# EAGLE design Rain_alarm (EAGLE 9.6.2)
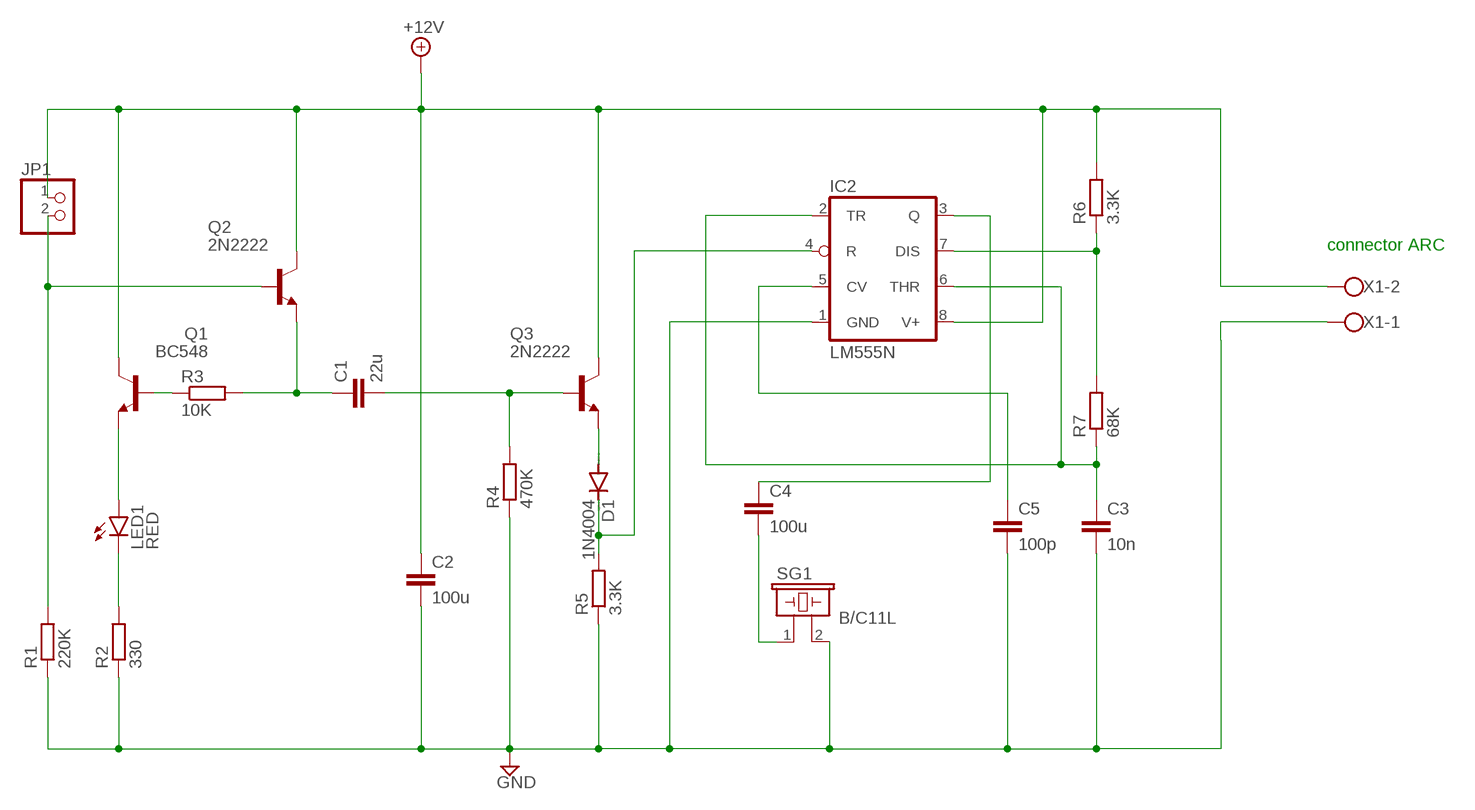
[diagram p0: schematic, sheet 1]

## Parts
C1  22u  C-EU025-025X050  [C025-025X050]
C2  100u  C-EU025-025X050  [C025-025X050]
C3  10n  C-EU025-025X050  [C025-025X050]
C4  100u  C-EU025-025X050  [C025-025X050]
C5  100p  C-EU025-025X050  [C025-025X050]
D1  1N4004  [DO41-10]
IC2  LM555N  [DIL08]
JP1  PINHD-1X2  [1X02]
LED1  RED  LED3MM  [LED3MM]
Q1  BC548  [TO92-EBC]
Q2  2N2222  [TO18]
Q3  2N2222  [TO18]
R1  220K  R-EU_0204/7  [0204/7]
R2  330  R-EU_0204/7  [0204/7]
R3  10K  R-EU_0204/7  [0204/7]
R4  470K  R-EU_0204/7  [0204/7]
R5  3.3K  R-EU_0204/7  [0204/7]
R6  3.3K  R-EU_0204/7  [0204/7]
R7  68K  R-EU_0204/7  [0204/7]
SG1  B/C11L  [B/C11L]
X1  W237-102  [W237-102]

## Nets
+12V: C2.1 IC2.8(V+) JP1.1 Q1.C Q2.3(C) Q3.3(C) R6.2 X1.2
GND: C2.2 C3.2 C5.2 IC2.1(GND) R1.1 R2.1 R4.1 R5.1 SG1.2 X1.1
N$1: IC2.7(DIS) R6.1 R7.2
N$2: C3.1 IC2.2(TR) IC2.6(THR) R7.1
N$3: C1.2 Q3.2(B) R4.2
N$4: C1.1 Q2.1(E) R3.2
N$6: D1.A Q3.1(E)
N$7: D1.C IC2.4(R) R5.2
N$8: JP1.2 Q2.2(B) R1.2
N$9: LED1.K(C) R2.2
N$10: LED1.A Q1.E
N$11: Q1.B R3.1
N$12: C4.1 IC2.3(Q)
N$13: C4.2 SG1.1
N$14: C5.1 IC2.5(CV)

## Notes on the sheet
- connector ARC

## Library data of the parts
C1-C5 = rcl:C-EU: CAPACITOR, European symbol; SPICEPREFIX: C
D1 = diode:1N4004: DIODE general purpose rectifier, 1 A
IC2 = linear:*555: TIMER
JP1 = pinhead:PINHD-1X2: PIN HEADER
LED1 = led:LED: LED OSRAM: - CHIPLED LG R971, LG N971, LY N971, LG Q971, LY Q971, LO R971, LY R971 LH N974, LH R974 LS Q976, LO Q976, LY Q976 LO Q996 - Hyper CHIPLED LW Q18S LB Q993, LB Q99A, LB R99A - SideLED LS A670, LO A670, LY A670, LG A670, LP A670 LB A673, LV A673, LT A673, LW A673 LH A674 LY A675 LS A676, LA A676, LO A676, LY A676, LW A676 LS A679, LY A679, LG A679 - Hyper Micro SIDELED® LS Y876, LA Y876, LO Y876, LY Y876 LT Y87S - SmartLED LW L88C, LW L88S LB L89C, LB L89S, LG L890 LS L89K, LO L89K, LY L89K LS L896, LA L896, LO L896, LY L896 - TOPLED LS T670, LO T670, LY T670, LG T670, LP T670 LSG T670, LSP T670, LSY T670, LOP T670, LYG T670 LG T671, LOG T671, LSG T671 LB T673, LV T673, LT T673, LW T673 LH T674 LS T676, LA T676, LO T676, LY T676, LB T676, LH T676, LSB T676, LW T676 LB T67C, LV T67C, LT T67C, LS T67K, LO T67K, LY T67K, LW E67C LS E67B, LA E67B, LO E67B, LY E67B, LB E67C, LV E67C, LT E67C LW T67C LS T679, LY T679, LG T679 LS T770, LO T770, LY T770, LG T770, LP T770 LB T773, LV T773, LT T773, LW T773 LH T774 LS E675, LA E675, LY E675, LS T675 LS T776, LA T776, LO T776, LY T776, LB T776 LHGB T686 LT T68C, LB T68C - Hyper Mini TOPLED® LB M676 - Mini TOPLED Santana® LG M470 LS M47K, LO M47K, LY M47K Source: http://www.osram.convergy.de LUXEON: - LUMILED® LXK2-PW12-R00, LXK2-PW12-S00, LXK2-PW14-U00, LXK2-PW14-V00 LXK2-PM12-R00, LXK2-PM12-S00, LXK2-PM14-U00 LXK2-PE12-Q00, LXK2-PE12-R00, LXK2-PE12-S00, LXK2-PE14-T00, LXK2-PE14-U00 LXK2-PB12-K00, LXK2-PB12-L00, LXK2-PB12-M00, LXK2-PB14-N00, LXK2-PB14-P00, LXK2-PB14-Q00 LXK2-PR12-L00, LXK2-PR12-M00, LXK2-PR14-Q00, LXK2-PR14-R00 LXK2-PD12-Q00, LXK2-PD12-R00, LXK2-PD12-S00 LXK2-PH12-R00, LXK2-PH12-S00 LXK2-PL12-P00, LXK2-PL12-Q00, LXK2-PL12-R00 Source: www.luxeon.com KINGBRIGHT: KA-3528ASYC Source: www.kingbright.com
Q1 = transistor-npn:BC548*: NPN Transistor
Q2 Q3 = transistor-neu-to92:2N2222: NPN TRANSISTOR
R1-R7 = rcl:R-EU_: RESISTOR, European symbol; SPICEPREFIX: R
SG1 = buzzer:B/C11L: BUZZER Source: Buerklin; OC_FARNELL: unknown; OC_NEWARK: unknown
X1 = con-wago-500:W237-102: WAGO SCREW CLAMP; MPN: 237-102; OC_FARNELL: unknown; OC_NEWARK: 70K9898

## Board
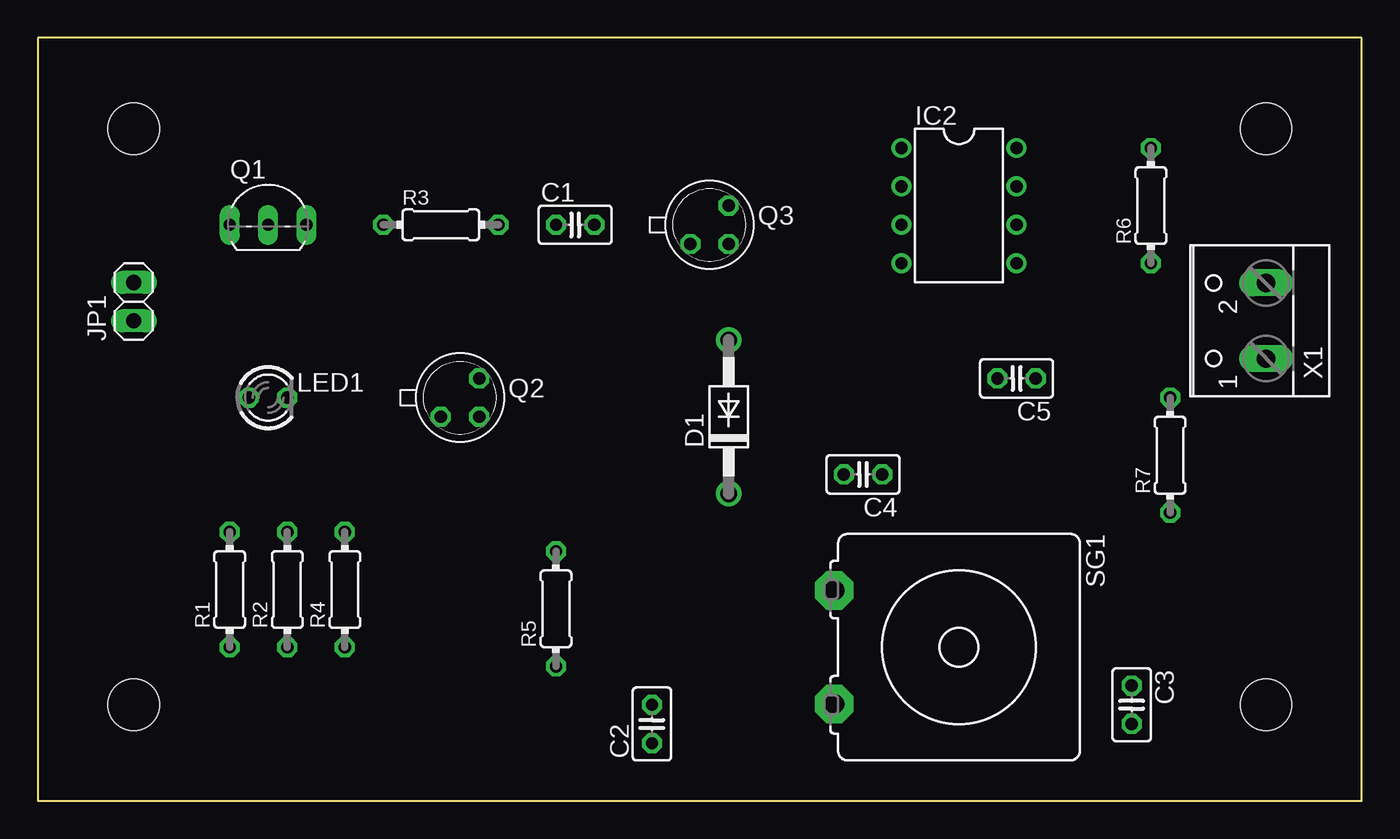
[diagram p1: board, top side]
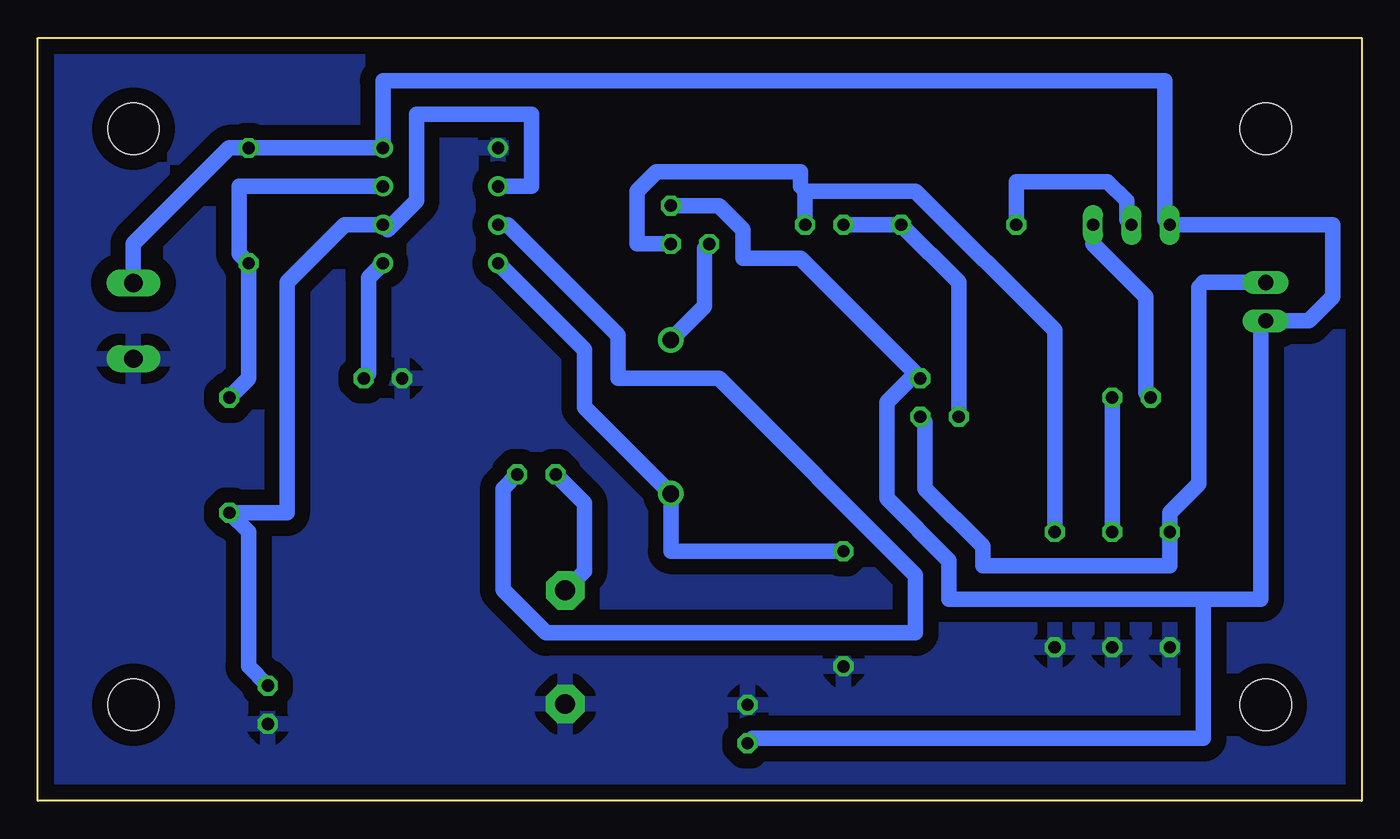
[diagram p2: board, bottom side, seen from below]

Size 87.61 x 50.47 mm. Coordinates in mm from the lower left corner, seen from the top.
Outline: 0,0 87.61,0 87.61,50.47 0,50.47 0,0
Copper layers (1*16): Top 0.035mm / dielectric 1.5mm / Bottom 0.035mm
Design rules "default *": minimum track width 40mil, minimum drill 0.6mm, track to track 40mil, track to pad 40mil, pad to pad 40mil, via to via 6mil, smd to smd 6mil, copper to edge 40mil, drill to drill 6mil, minimum pad ring 10mil, minimum via ring 8mil, stop-mask expansion 4mil, vias tented up to drill 0mil, thermal gap 30mil
Holes 3.4 mm at 6.35,44.45 81.28,44.45 81.28,6.35 6.35,6.35

### Footprints (pad centres in the part's own frame; a part is rotated, then mirrored left to right if it is on the bottom)
C025-025X050 = drill 0.813 octagon: 1 -1.27,0; 2 1.27,0
DO41-10 = drill 1.118: A 5.08,0; C -5.08,0
DIL08 = drill 0.813 pad 1.27: 1 -3.81,-3.81; 2 -1.27,-3.81; 3 1.27,-3.81; 4 3.81,-3.81; 5 3.81,3.81; 6 1.27,3.81; 7 -1.27,3.81; 8 -3.81,3.81
1X02 = drill 1.016 long: 1 -1.27,0; 2 1.27,0
LED3MM = drill 0.813 octagon: A -1.27,0; K 1.27,0
TO92-EBC = drill 0.813 long: B 0,-1.27; C -2.54,-1.27; E 2.54,-1.27
TO18 = drill 0.813 octagon: 1 -1.27,-1.27; 2 1.27,-1.27; 3 1.27,1.27
0204/7 = drill 0.813 octagon: 1 -3.81,0; 2 3.81,0
B/C11L = drill 1.321 pad 2.54 octagon: 1 -3.759,-8.255; 2 3.759,-8.255
W237-102 = drill 1.194 long: 1 -2.5,-1.27; 2 2.5,-1.27

### Placement (x,y rotation side)
C1  35.56,38.1 0 top
C2  40.64,5.08 90 top
C3  72.39,6.35 270 top
C4  54.61,21.59 180 top
C5  64.77,27.94 180 top
D1  45.72,25.4 90 top
IC2  60.96,39.37 270 top
JP1  6.35,33.02 90 top
LED1  15.24,26.67 0 top
Q1  15.24,39.37 0 top
Q2  27.94,26.67 0 top
Q3  44.45,38.1 0 top
R1  12.7,13.97 90 top
R2  16.51,13.97 90 top
R3  26.67,38.1 0 top
R4  20.32,13.97 90 top
R5  34.29,12.7 90 top
R6  73.66,39.37 90 top
R7  74.93,22.86 90 top
SG1  60.96,10.16 270 top
X1  80.01,31.75 90 top

### Tracks (layer width: path | path; a pad name or v marks a point on that pad's centre or on a via)
+12V
  Bottom 1.016: Q3.3 42.55,39.37 40.96,37.78 40.96,35.88 37.15,35.88 Q2.3 29.85,27.94 31.43,26.35 31.43,20 27.3,15.88 27.3,13.34 10.48,13.34 | C2.1 40.32,4.13 10.48,4.13 10.48,13.34 | 10.48,13.34 6.67,13.34 6.67,31.43 JP1.1 3.49,31.75 1.91,33.34 1.91,38.1 Q1.C 13.02,38.42 13.02,47.62 64.77,47.62 IC2.8 R6.2 74.93,43.18 81.28,36.83 X1.2
GND
  pour Bottom: 0,50.8 87.63,50.8 87.63,0 0,0
N$1
  Bottom 1.016: R7.2 73.66,27.94 R6.1 74.3,36.19 74.3,40.64 IC2.7
N$2
  Bottom 1.016: C3.1 73.66,8.89 73.66,17.78 R7.1 71.12,19.05 71.12,34.29 67.31,38.1 IC2.6 64.45,37.78 62.55,39.69 62.55,45.4 54.93,45.4 54.93,40.64 IC2.2
N$3
  Bottom 1.016: R4.2 20.32,31.11 29.53,40.32 36.83,40.32 | C1.2 36.83,40.32 | Q3.2 47.94,36.83 47.94,40.32 46.67,41.59 37.15,41.59 37.15,40.64 36.83,40.32
N$4
  Bottom 1.016: Q2.1 26.67,34.29 R3.2 C1.1
N$6
  Bottom 1.016: Q3.1 43.5,36.51 43.5,32.7 D1.A
N$7
  Bottom 1.016: R5.2 45.72,16.51 D1.C 51.43,26.04 51.43,29.85 IC2.4
N$8
  Bottom 1.016: JP1.2 10.48,34.29 10.8,33.97 10.8,20.95 12.7,19.05 R1.2 12.7,15.56 25.08,15.56 25.08,16.83 28.89,20.64 28.89,25.08 Q2.2
N$9
  Bottom 1.016: LED1.K R2.2
N$10
  Bottom 1.016: LED1.A 14.29,26.99 14.29,33.34 17.78,36.83 Q1.E
N$11
  Bottom 1.016: Q1.B 15.56,38.42 15.56,39.69 16.83,40.96 22.86,40.96 R3.1
N$12
  Bottom 1.016: C4.1 56.83,20.64 56.83,13.97 53.98,11.11 29.53,11.11 29.53,14.92 42.55,27.94 49.21,27.94 49.21,30.8 56.52,38.1 IC2.3
N$13
  Bottom 1.016: C4.2 51.43,19.68 51.43,15.19 SG1.1
N$14
  Bottom 1.016: C5.1 65.72,28.26 65.72,34.61 IC2.5